# EAGLE design fob (EAGLE 9.6.1)
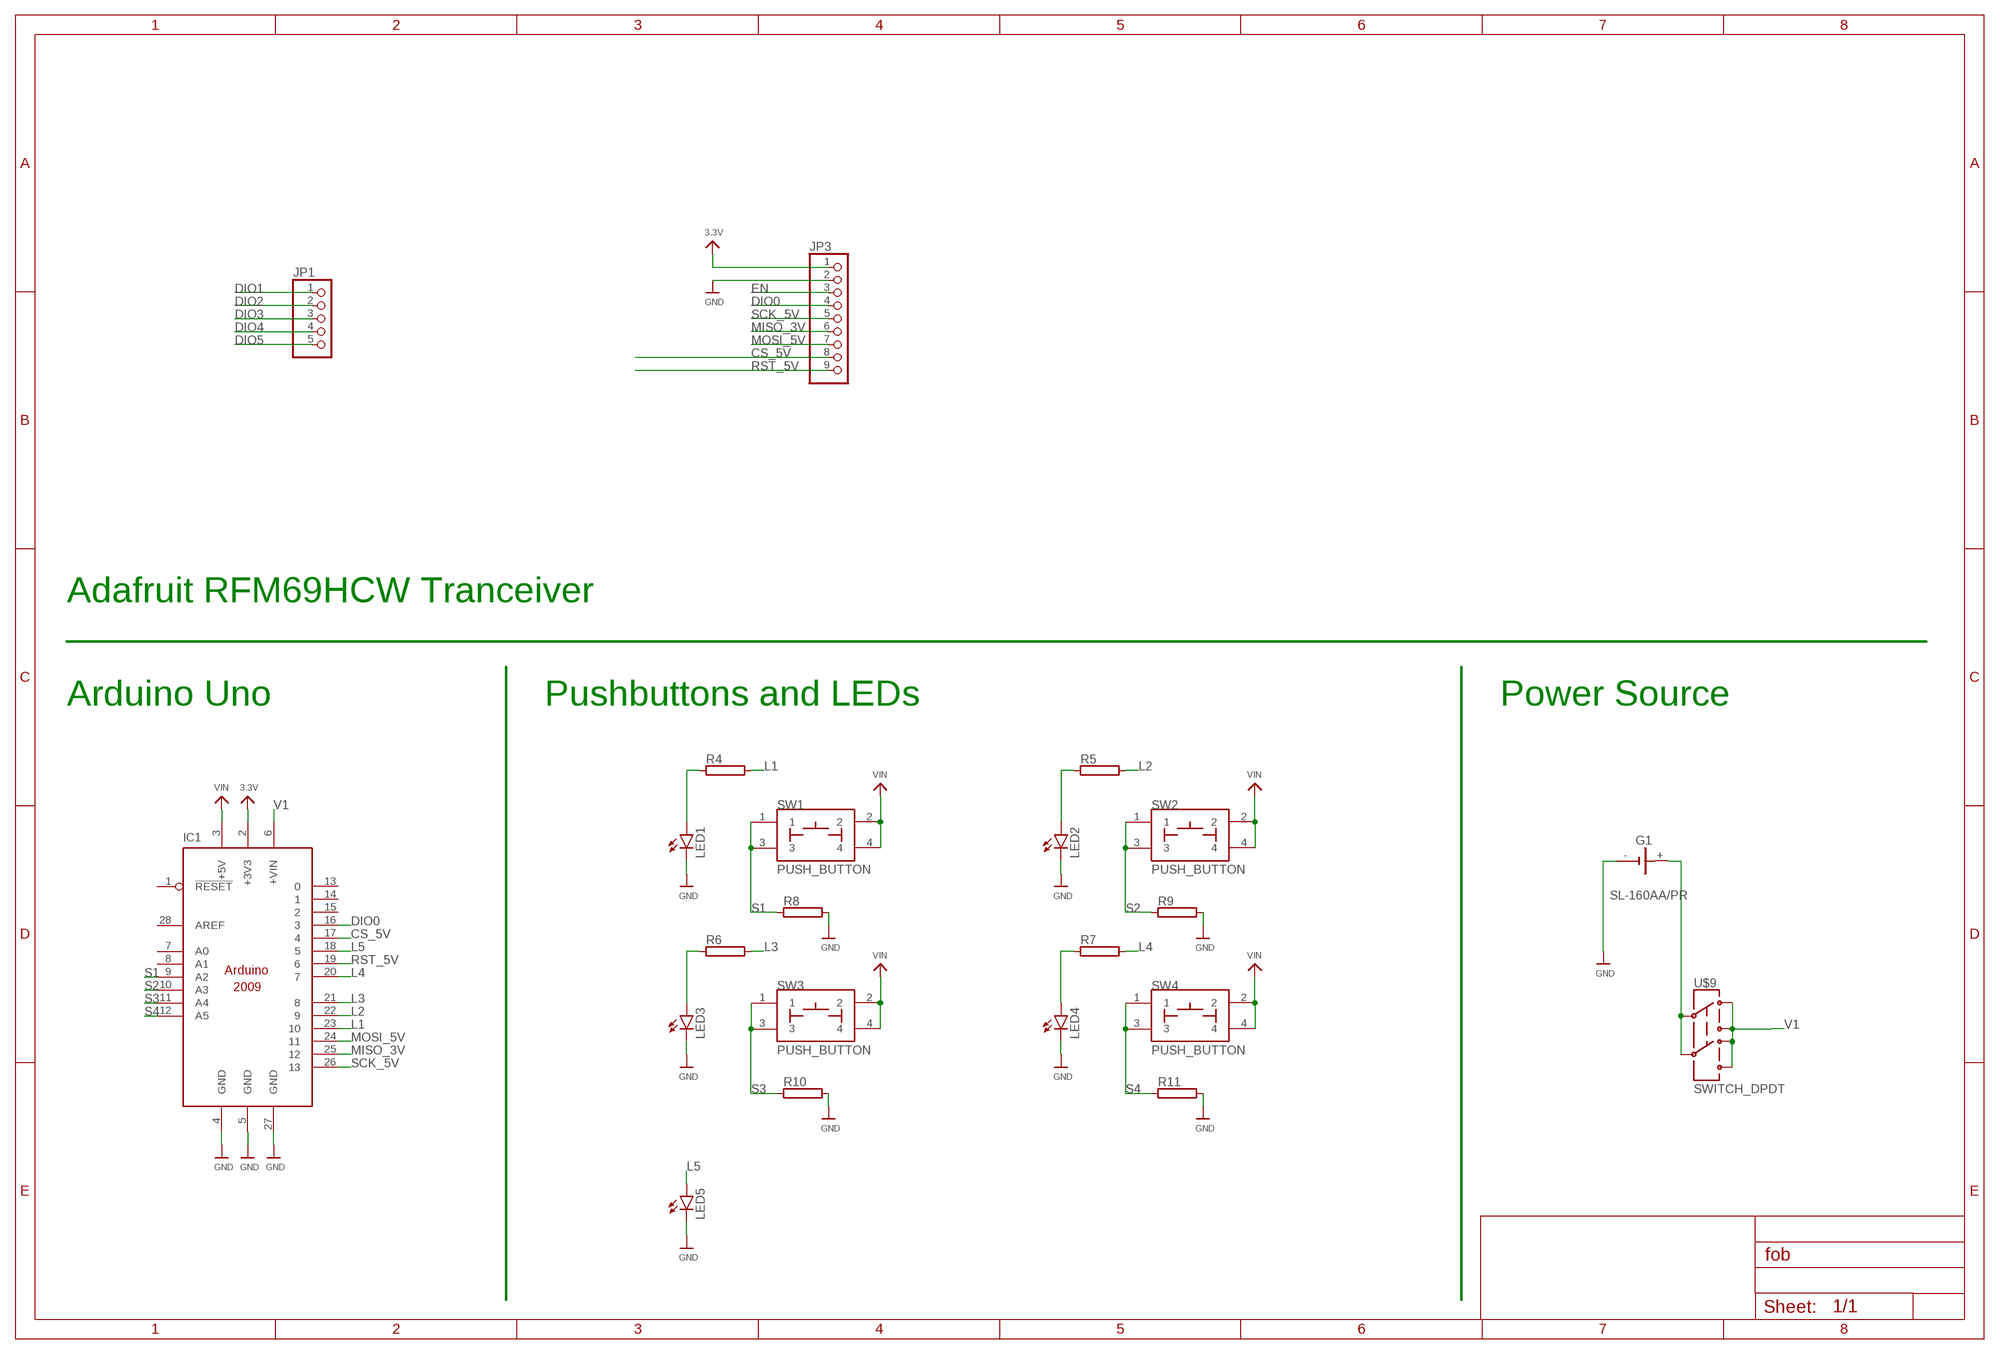
[diagram p0: schematic, sheet 1]

## Parts
G1  SL-160AA/PR  [SL-160AA/PR]
IC1  ARDUINO2009_10  [ARDUINO2009]
JP1  HEADER-1X570MIL  [1X05_ROUND_70]
JP3  HEADER-1X970MIL  [1X09_ROUND_70]
LED1  LED5MM  [LED5MM]
LED2  LED5MM  [LED5MM]
LED3  LED5MM  [LED5MM]
LED4  LED5MM  [LED5MM]
LED5  LED5MM  [LED5MM]
R4  RAC01  [AC01]
R5  RAC01  [AC01]
R6  RAC01  [AC01]
R7  RAC01  [AC01]
R8  RAC01  [AC01]
R9  RAC01  [AC01]
R10  RAC01  [AC01]
R11  RAC01  [AC01]
SW1  PUSH_BUTTON  [BUTTON_12.5MM]
SW2  PUSH_BUTTON  [BUTTON_12.5MM]
SW3  PUSH_BUTTON  [BUTTON_12.5MM]
SW4  PUSH_BUTTON  [BUTTON_12.5MM]
U$9  SWITCH_DPDT  [JS_DPDT_TH]

## Nets
3.3V: IC1.2(+3V3) JP3.1
CS_5V: IC1.17 JP3.8
DIO0: IC1.16 JP3.4
DIO1: JP1.1
DIO2: JP1.2
DIO3: JP1.3
DIO4: JP1.4
DIO5: JP1.5
EN: JP3.3
GND: G1.- IC1.4(GND) IC1.5(GND) IC1.27(GND) JP3.2 LED1.K(C) LED2.K(C) LED3.K(C) LED4.K(C) LED5.K(C) R8.2 R9.2 R10.2 R11.2
L1: IC1.23 R4.2
L2: IC1.22 R5.2
L3: IC1.21 R6.2
L4: IC1.20 R7.2
L5: IC1.18 LED5.A
MISO_3V: IC1.25 JP3.6
MOSI_5V: IC1.24 JP3.7
N$1: G1.+ U$9.2 U$9.5
N$4: LED1.A R4.1
N$5: LED3.A R6.1
N$6: LED2.A R5.1
N$7: LED4.A R7.1
RST_5V: IC1.19 JP3.9
S1: IC1.9(A2) R8.1 SW1.1 SW1.3
S2: IC1.10(A3) R9.1 SW2.1 SW2.3
S3: IC1.11(A4) R10.1 SW3.1 SW3.3
S4: IC1.12(A5) R11.1 SW4.1 SW4.3
SCK_5V: IC1.26 JP3.5
V1: IC1.6(+VIN) U$9.1 U$9.3 U$9.4 U$9.6
VIN: IC1.3(+5V) SW1.2 SW1.4 SW2.2 SW2.4 SW3.2 SW3.4 SW4.2 SW4.4
Unconnected: IC1.1(!RESET) IC1.7(A0) IC1.8(A1) IC1.13 IC1.14 IC1.15 IC1.28(AREF)

## Notes on the sheet
- Adafruit RFM69HCW Tranceiver
- Arduino Uno | Pushbuttons and LEDs | Power Source

## Library data of the parts
G1 = battery:SL-160AA/PR: LI BATTERY Sonnenschein
IC1 = arduino:ARDUINO2009_1: The Arduino Duemilanove ("2009") is a microcontroller board based on the ATmega168 or ATmega328. - 14 digital input/output pins (of which 6 can be used as PWM outputs) - 6 analog inputs, a 16 MHz crystal oscillator - USB connection - power jack - ISP header - reset button It contains everything needed to support the microcontroller; simply connect it to a computer with a USB cable or power it with a AC-to-DC adapter or battery to get started http://arduino.cc/en/Main/ArduinoBoardDuemilanove
JP1 = microbuilder:HEADER-1X5: PIN HEADER
JP3 = microbuilder:HEADER-1X9: PIN HEADER
LED1-LED5 = led:LED: LED OSRAM: - CHIPLED LG R971, LG N971, LY N971, LG Q971, LY Q971, LO R971, LY R971 LH N974, LH R974 LS Q976, LO Q976, LY Q976 LO Q996 - Hyper CHIPLED LW Q18S LB Q993, LB Q99A, LB R99A - SideLED LS A670, LO A670, LY A670, LG A670, LP A670 LB A673, LV A673, LT A673, LW A673 LH A674 LY A675 LS A676, LA A676, LO A676, LY A676, LW A676 LS A679, LY A679, LG A679 - Hyper Micro SIDELED® LS Y876, LA Y876, LO Y876, LY Y876 LT Y87S - SmartLED LW L88C, LW L88S LB L89C, LB L89S, LG L890 LS L89K, LO L89K, LY L89K LS L896, LA L896, LO L896, LY L896 - TOPLED LS T670, LO T670, LY T670, LG T670, LP T670 LSG T670, LSP T670, LSY T670, LOP T670, LYG T670 LG T671, LOG T671, LSG T671 LB T673, LV T673, LT T673, LW T673 LH T674 LS T676, LA T676, LO T676, LY T676, LB T676, LH T676, LSB T676, LW T676 LB T67C, LV T67C, LT T67C, LS T67K, LO T67K, LY T67K, LW E67C LS E67B, LA E67B, LO E67B, LY E67B, LB E67C, LV E67C, LT E67C LW T67C LS T679, LY T679, LG T679 LS T770, LO T770, LY T770, LG T770, LP T770 LB T773, LV T773, LT T773, LW T773 LH T774 LS E675, LA E675, LY E675, LS T675 LS T776, LA T776, LO T776, LY T776, LB T776 LHGB T686 LT T68C, LB T68C - Hyper Mini TOPLED® LB M676 - Mini TOPLED Santana® LG M470 LS M47K, LO M47K, LY M47K Source: http://www.osram.convergy.de LUXEON: - LUMILED® LXK2-PW12-R00, LXK2-PW12-S00, LXK2-PW14-U00, LXK2-PW14-V00 LXK2-PM12-R00, LXK2-PM12-S00, LXK2-PM14-U00 LXK2-PE12-Q00, LXK2-PE12-R00, LXK2-PE12-S00, LXK2-PE14-T00, LXK2-PE14-U00 LXK2-PB12-K00, LXK2-PB12-L00, LXK2-PB12-M00, LXK2-PB14-N00, LXK2-PB14-P00, LXK2-PB14-Q00 LXK2-PR12-L00, LXK2-PR12-M00, LXK2-PR14-Q00, LXK2-PR14-R00 LXK2-PD12-Q00, LXK2-PD12-R00, LXK2-PD12-S00 LXK2-PH12-R00, LXK2-PH12-S00 LXK2-PL12-P00, LXK2-PL12-Q00, LXK2-PL12-R00 Source: www.luxeon.com KINGBRIGHT: KA-3528ASYC Source: www.kingbright.com
R4-R11 = resistor-power:R: Power Resitor; OC_FARNELL: unknown; OC_NEWARK: unknown
SW1-SW4 = MISC:PUSH_BUTTON
U$9 = ELEC327:SWITCH_DPDT

## Board
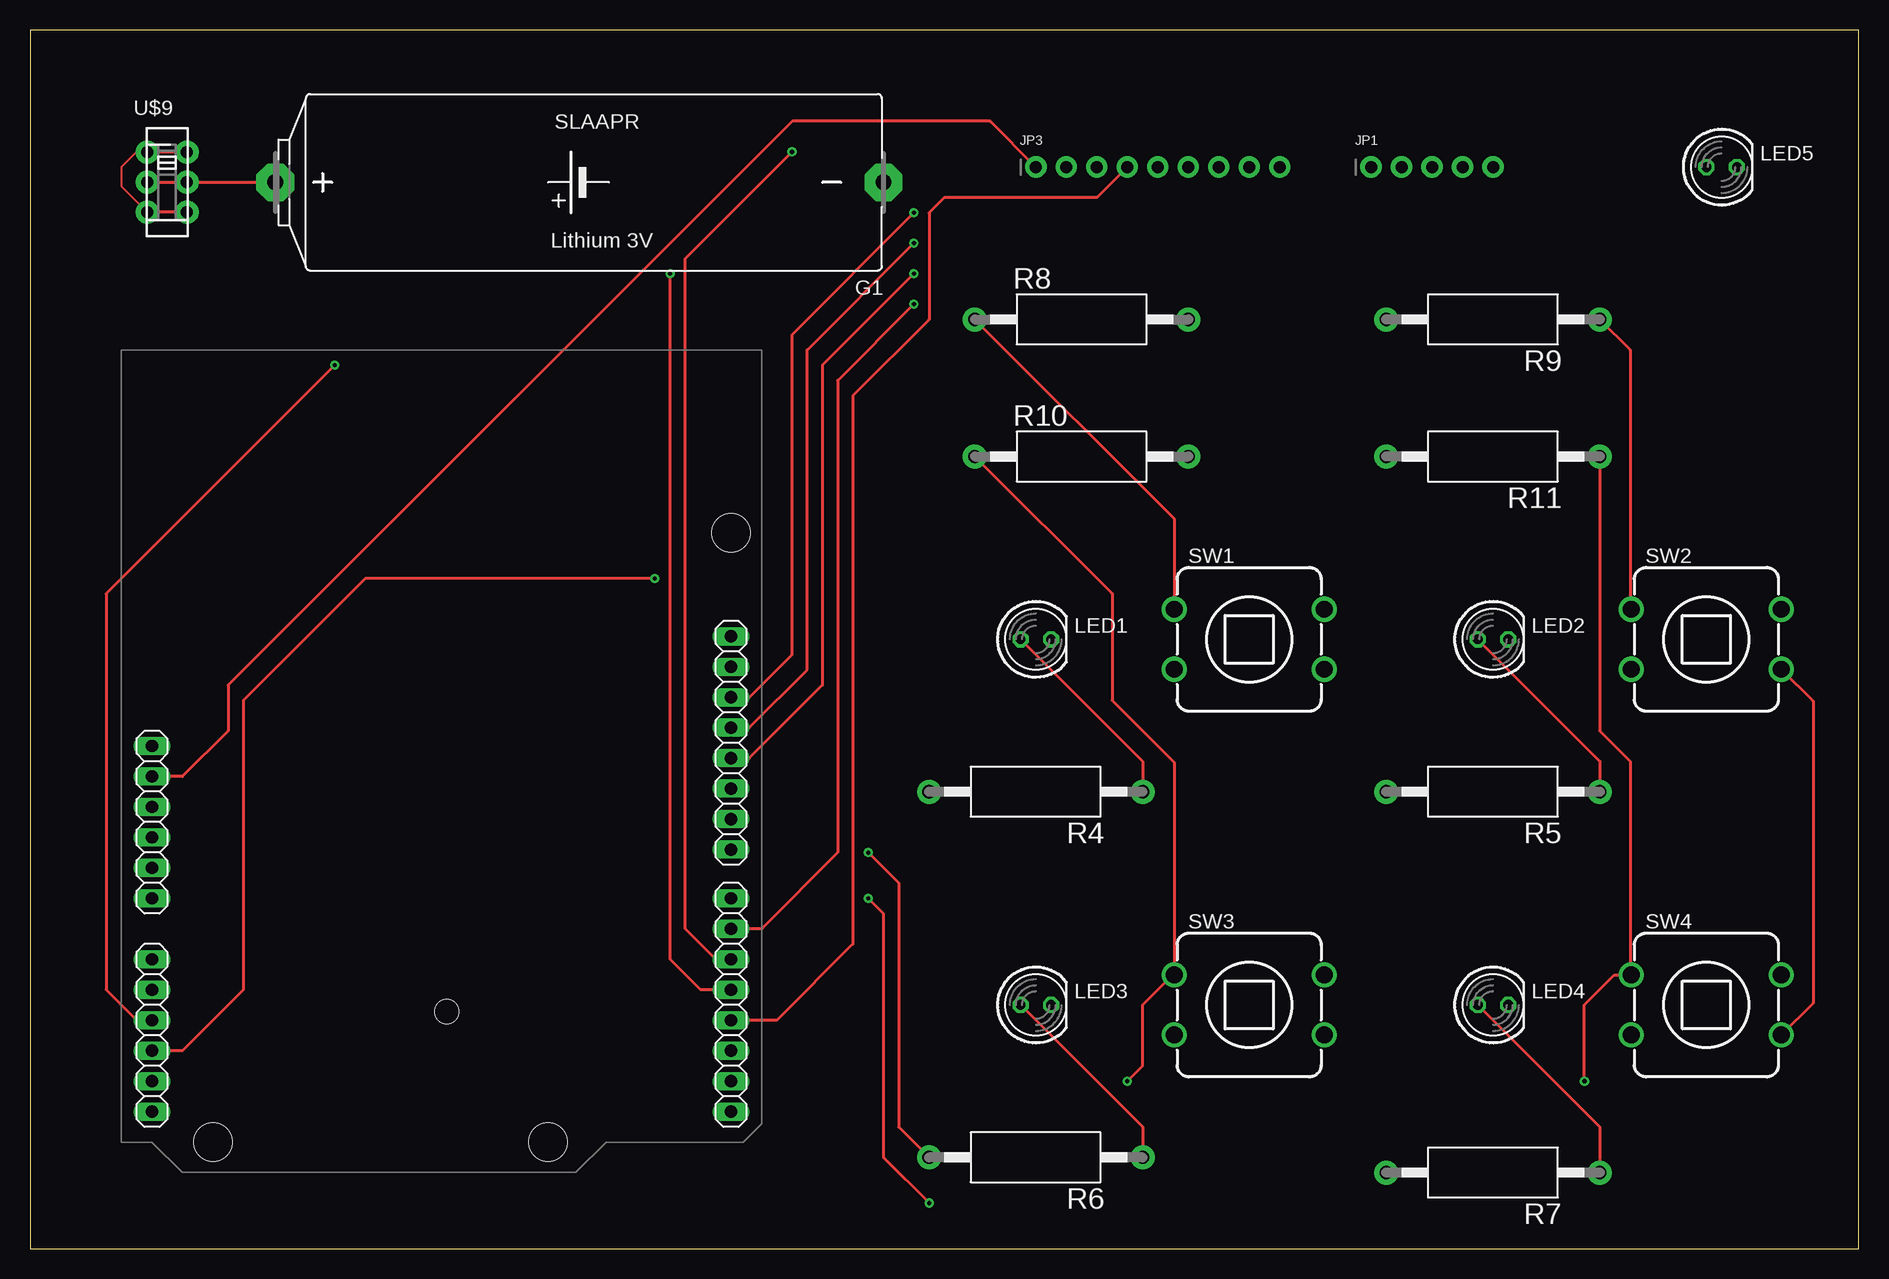
[diagram p1: board, top side]
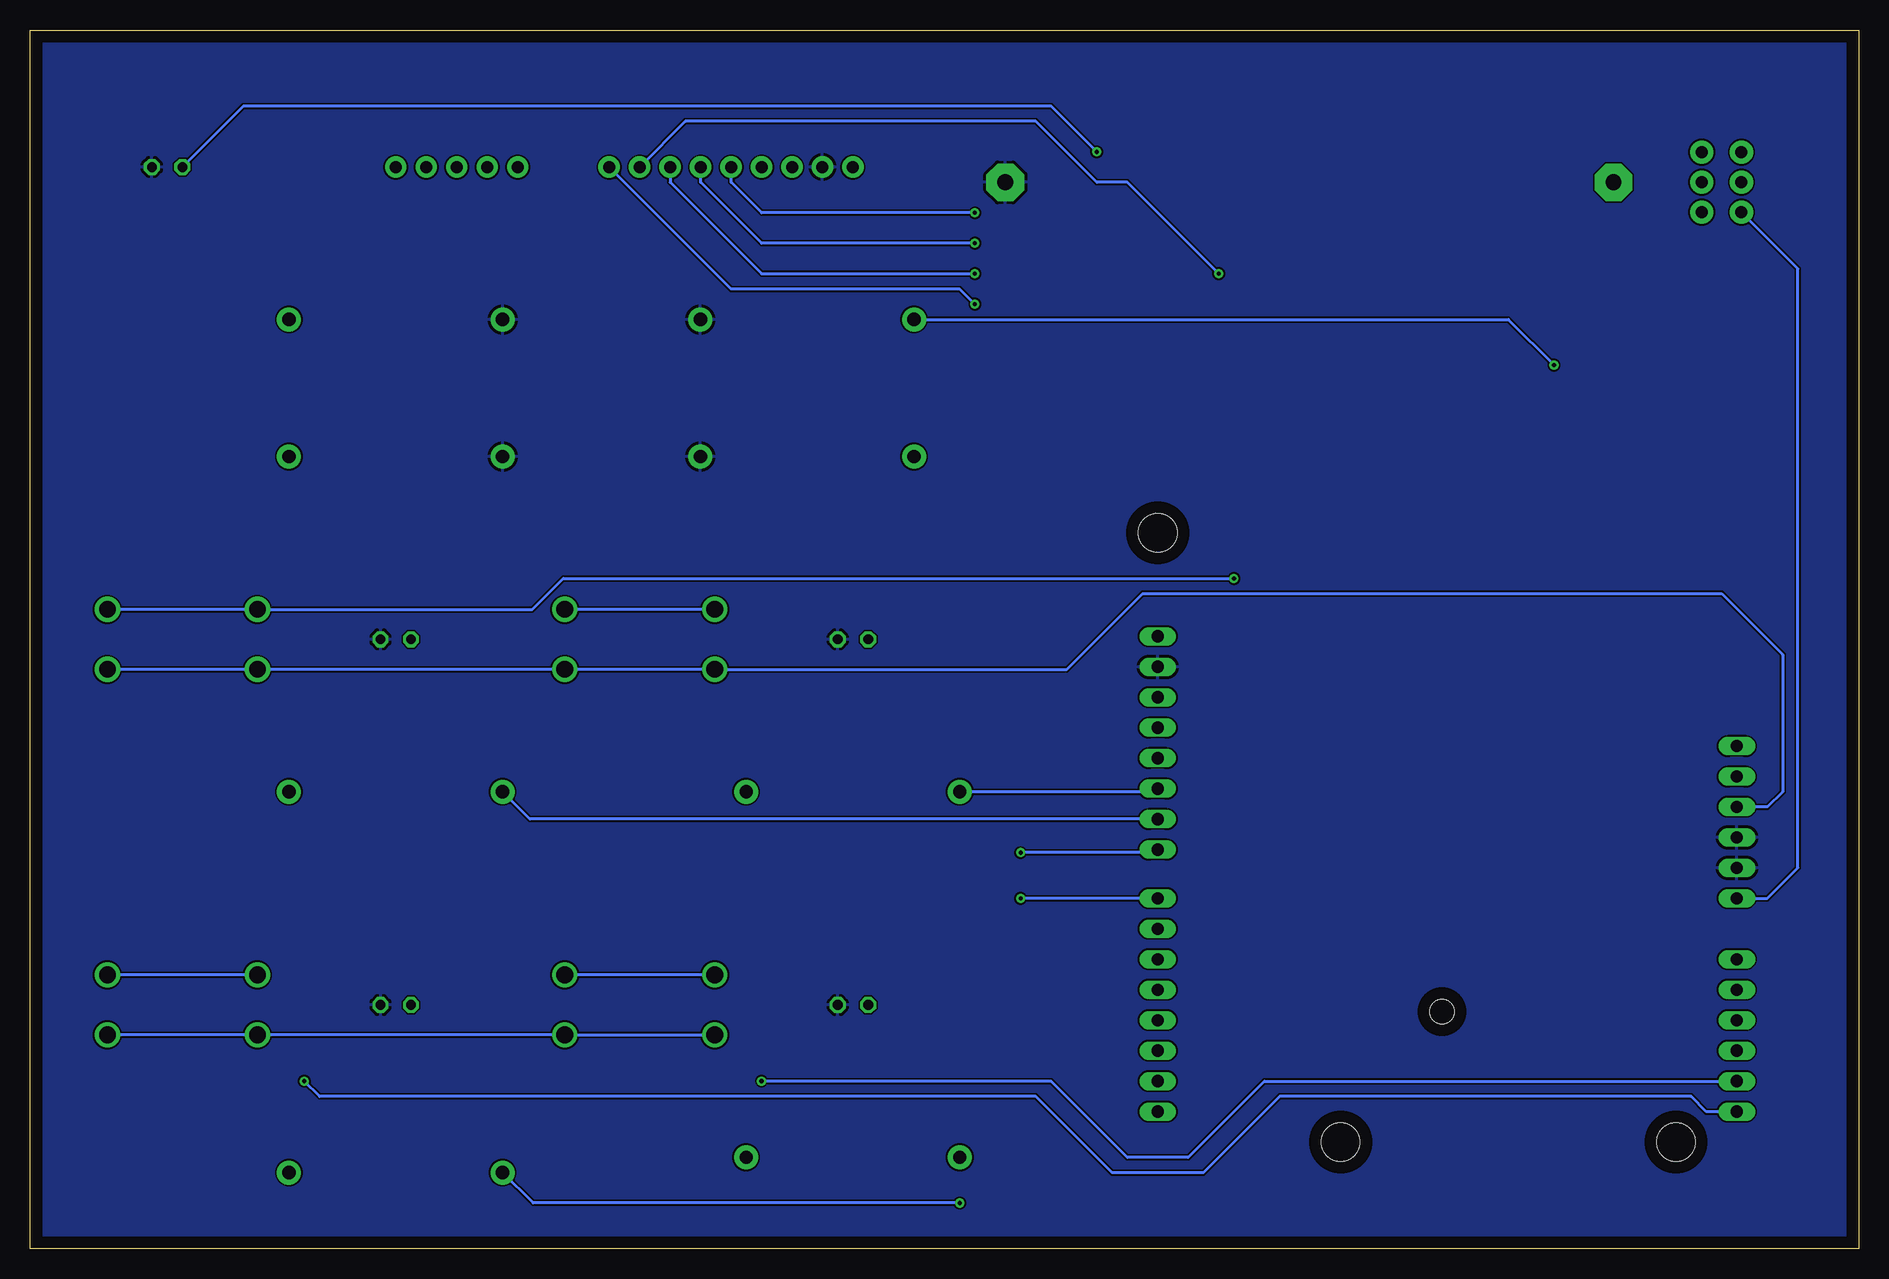
[diagram p2: board, bottom side, seen from below]

Size 152.4 x 101.6 mm. Coordinates in mm from the lower left corner, seen from the top.
Outline: 0,0 152.4,0 152.4,101.6 0,101.6 0,0
Copper layers (1*16): Top 0.035mm / dielectric 1.5mm / Bottom 0.035mm
Design rules "default": minimum track width 6mil, minimum drill 0.35mm, track to track 6mil, track to pad 6mil, pad to pad 6mil, via to via 6mil, smd to smd 6mil, copper to edge 40mil, drill to drill 6mil, minimum pad ring 10mil, minimum via ring 8mil, stop-mask expansion 4mil, vias tented up to drill 0mil, thermal gap 10mil

### Footprints (pad centres in the part's own frame; a part is rotated, then mirrored left to right if it is on the bottom)
SL-160AA/PR = drill 1.321 pad 3.15 octagon: + 25.273,0; - -25.4,0
ARDUINO2009 = drill 1.016 long: 1 33.02,2.54; 2 35.56,2.54; 3 38.1,2.54; 4 40.64,2.54; 5 43.18,2.54; 6 45.72,2.54; 7 50.8,2.54; 8 53.34,2.54; 9 55.88,2.54; 10 58.42,2.54; 11 60.96,2.54; 12 63.5,2.54; 13 63.5,50.8; 14 60.96,50.8; 15 58.42,50.8; 16 55.88,50.8; 17 53.34,50.8; 18 50.8,50.8; 19 48.26,50.8; 20 45.72,50.8; 21 41.656,50.8; 22 39.116,50.8; 23 36.576,50.8; 24 34.036,50.8; 25 31.496,50.8; 26 28.956,50.8; 27 26.416,50.8; 28 23.876,50.8 | hole 3.2: 15.24,50.8; 66.04,35.56; 66.04,7.62 | hole 2: 55.17,27.114
1X05_ROUND_70 = drill 1 pad 1.778: 1 -5.08,0; 2 -2.54,0; 3 0,0; 4 2.54,0; 5 5.08,0
1X09_ROUND_70 = drill 1 pad 1.778: 1 -10.16,0; 2 -7.62,0; 3 -5.08,0; 4 -2.54,0; 5 0,0; 6 2.54,0; 7 5.08,0; 8 7.62,0; 9 10.16,0
LED5MM = drill 0.813 octagon: A -1.27,0; K 1.27,0
AC01 = drill 1.1 pad 2: 1 -8.9,0; 2 8.9,0
BUTTON_12.5MM = drill 1.4: 1 -6.25,2.5; 2 -6.25,-2.5; 3 6.25,2.5; 4 6.25,-2.5
JS_DPDT_TH = drill 1 pad 1.93: 1 -2.5,-1.65; 2 0,-1.65; 3 2.5,-1.65; 4 -2.5,1.65; 5 0,1.65; 6 2.5,1.65

### Placement (x,y rotation side)
G1  45.72,88.9 180 top
IC1  7.62,74.93 270 top
JP1  116.84,90.17 0 top
JP3  93.98,90.17 0 top
LED1  83.82,50.8 0 top
LED2  121.92,50.8 0 top
LED3  83.82,20.32 0 top
LED4  121.92,20.32 0 top
LED5  140.97,90.17 0 top
R4  83.82,38.1 180 top
R5  121.92,38.1 180 top
R6  83.82,7.62 180 top
R7  121.92,6.35 180 top
R8  87.63,77.47 0 top
R9  121.92,77.47 180 top
R10  87.63,66.04 0 top
R11  121.92,66.04 180 top
SW1  101.6,50.8 0 top
SW2  139.7,50.8 0 top
SW3  101.6,20.32 0 top
SW4  139.7,20.32 0 top
U$9  11.43,88.9 270 top

### Tracks (layer width: path | path; a pad name or v marks a point on that pad's centre or on a via)
3.3V
  Top 0.254: JP3.1 80.01,93.98 63.5,93.98 16.51,46.99 16.51,43.18 12.7,39.37 IC1.2
CS_5V  (via drill 0.35)
  Top 0.254: IC1.17 55.88,21.59 53.34,24.13 v53.34,81.28
  Bottom 0.254: v53.34,81.28 60.96,88.9 63.5,88.9 68.58,93.98 97.79,93.98 JP3.8
DIO0
  Top 0.254: JP3.4 88.9,87.63 76.2,87.63 74.93,86.36 74.93,77.47 68.58,71.12 68.58,25.4 62.23,19.05 IC1.16
GND
  pour Bottom: 0,106.68 157.48,106.68 157.48,-7.62 -5.08,-5.08 -5.08,106.68
L1
  Bottom 0.254: IC1.23 58.67,38.1 R4.2
L2
  Bottom 0.254: IC1.22 110.73,35.81 R5.2
L3  (via drill 0.35)
  Top 0.254: v69.85,33.02 72.39,30.48 72.39,10.15 R6.2
  Bottom 0.254: IC1.21 58.67,33.02 v69.85,33.02
L4  (via drill 0.35)
  Top 0.254: v69.85,29.21 71.12,27.94 71.12,7.62 v74.93,3.81
  Bottom 0.254: IC1.20 v69.85,29.21 | v74.93,3.81 110.48,3.81 R7.2
L5  (via drill 0.35)
  Top 0.254: IC1.18 57.15,24.13 54.61,26.67 54.61,82.55 v63.5,91.44
  Bottom 0.254: v63.5,91.44 67.31,95.25 134.62,95.25 LED5.A
MISO_3V  (via drill 0.35)
  Top 0.254: IC1.25 59.94,43.43 64.77,48.26 64.77,74.93 v73.66,83.82
  Bottom 0.254: JP3.6 96.52,88.9 91.44,83.82 v73.66,83.82
MOSI_5V  (via drill 0.35)
  Top 0.254: v73.66,81.28 66.04,73.66 66.04,46.99 59.94,40.89 IC1.24
  Bottom 0.254: JP3.7 99.06,88.9 91.44,81.28 v73.66,81.28
N$1
  Top 0.254: U$9.2 U$9.5 G1.+
N$4
  Top 0.254: LED1.A 92.72,40.63 R4.1
N$5
  Top 0.254: LED3.A 92.72,10.15 R6.1
N$6
  Top 0.254: LED2.A 130.82,40.63 R5.1
N$7
  Top 0.254: LED4.A 130.82,10.15 R7.1
RST_5V  (via drill 0.35)
  Top 0.254: v73.66,78.74 67.31,72.39 67.31,33.02 60.96,26.67 IC1.19
  Bottom 0.254: v73.66,78.74 74.93,80.01 93.98,80.01 JP3.9
S1  (via drill 0.35)
  Top 0.254: R8.1 95.35,60.85 SW1.1 | v25.4,73.66 6.35,54.61 6.35,21.59 8.89,19.05 IC1.9
  Bottom 0.254: SW1.1 SW1.3 | R8.1 29.21,77.47 v25.4,73.66
S2  (via drill 0.35)
  Top 0.254: R9.1 133.35,74.94 133.35,53.4 SW2.1 | v52.07,55.88 27.94,55.88 17.78,45.72 17.78,21.59 12.7,16.51 IC1.10
  Bottom 0.254: SW2.3 SW2.1 110.53,53.3 107.95,55.88 v52.07,55.88
S3  (via drill 0.35)
  Top 0.254: R10.1 90.17,54.6 90.17,45.72 95.35,40.54 SW3.1 95.21,22.82 92.71,20.32 92.71,15.24 v91.44,13.97
  Bottom 0.254: SW3.1 SW3.3 | v91.44,13.97 67.31,13.97 60.96,7.62 55.88,7.62 49.53,13.97 IC1.11
S4  (via drill 0.35)
  Top 0.254: v129.54,13.97 129.54,20.32 132.04,22.82 133.35,22.82 | 133.35,22.82 SW4.1 | R11.1 130.82,43.19 130.81,43.18 133.35,40.64 133.35,22.82
  Bottom 0.254: IC1.12 12.7,11.43 13.97,12.7 48.26,12.7 54.61,6.35 62.23,6.35 68.58,12.7 128.27,12.7 v129.54,13.97 | SW4.1 SW4.3
SCK_5V  (via drill 0.35)
  Top 0.254: IC1.26 59.94,45.97 63.5,49.53 63.5,76.2 v73.66,86.36
  Bottom 0.254: v73.66,86.36 91.44,86.36 93.98,88.9 JP3.5
V1
  Top 0.152: U$9.4 8.85,91.4 7.62,90.17 7.62,88.56 U$9.3
  Top 0.254: U$9.1 9.82,91.44 13.04,91.44 U$9.4 | U$9.6 U$9.3
  Bottom 0.254: IC1.6 7.62,29.21 5.08,31.75 5.08,81.7 U$9.3
VIN
  Top 0.254: SW2.4 148.59,45.66 148.59,20.46 SW4.4
  Bottom 0.254: SW2.4 SW2.2 SW1.4 SW1.2 66,48.3 59.69,54.61 11.43,54.61 6.35,49.53 6.35,38.1 7.62,36.83 IC1.3 | SW3.2 SW3.4 SW4.2 SW4.4